# EAGLE schematic schematic (EAGLE 6.5.0)
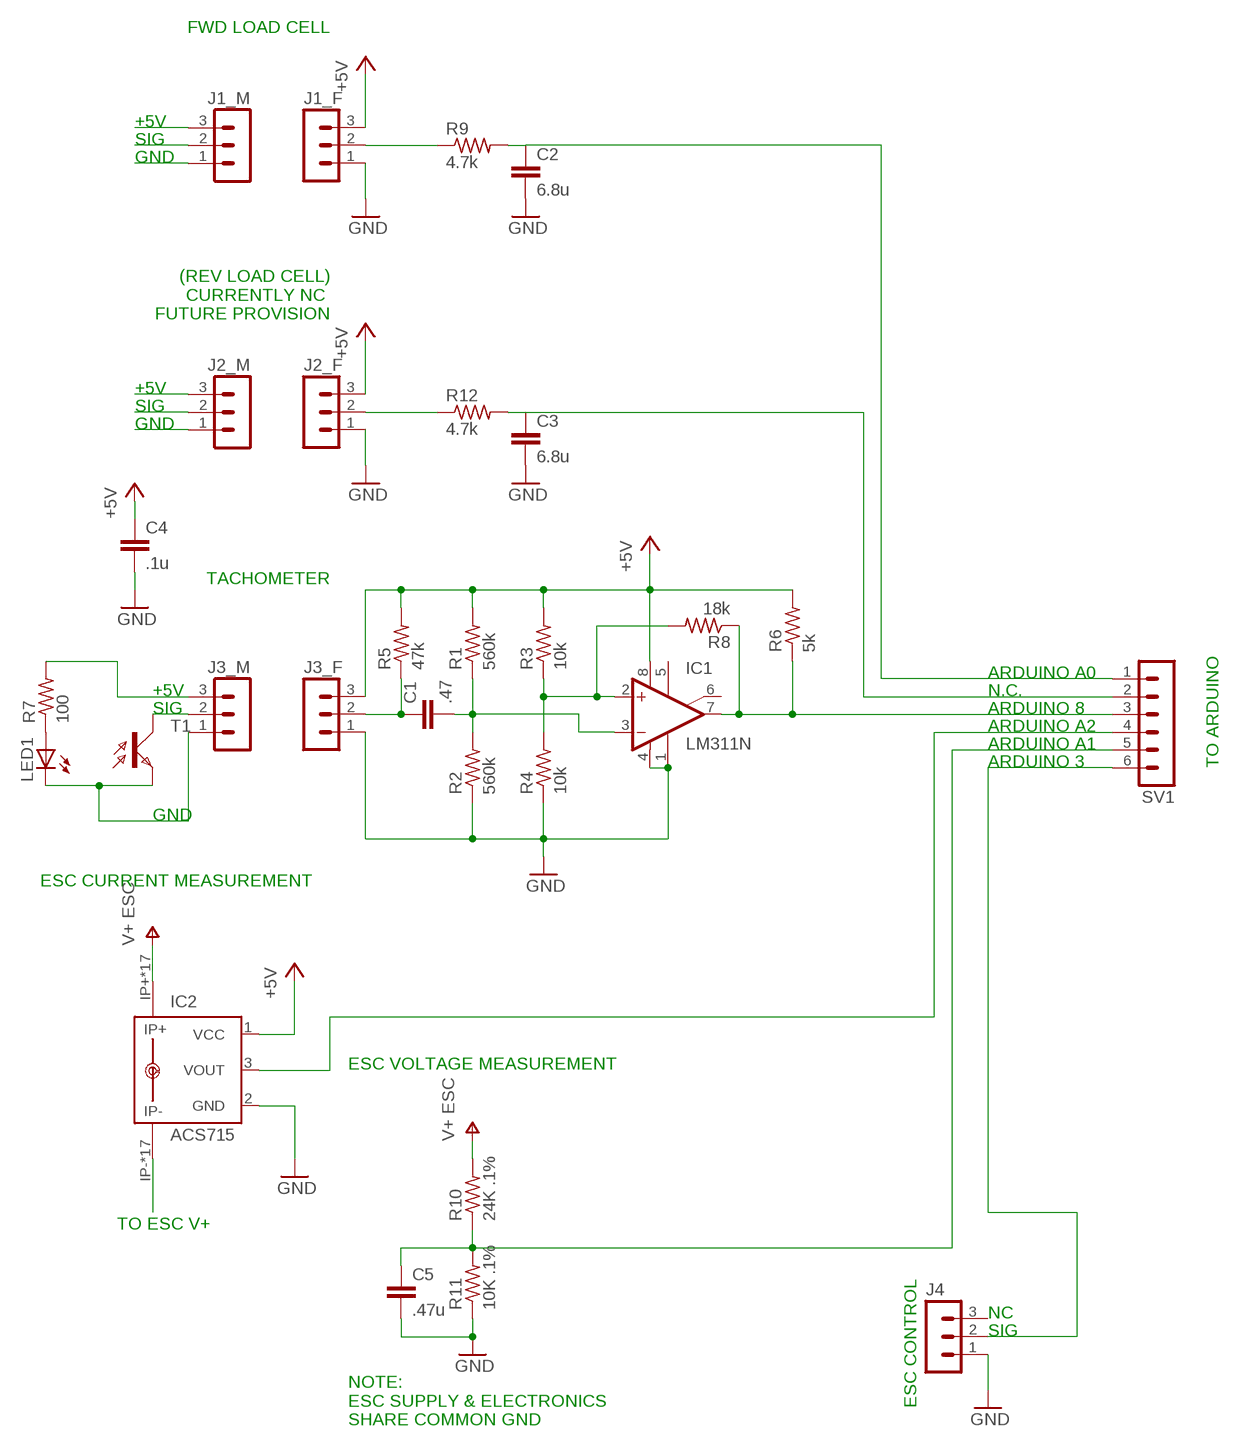
[diagram p0: schematic, sheet 1]

## Parts
C1  .47  C7.5/4  [C7.5B4]
C2  6.8u  C7.5/4  [C7.5B4]
C3  6.8u  C7.5/4  [C7.5B4]
C4  .1u  C7.5/4  [C7.5B4]
C5  .47u  C7.5/4  [C7.5B4]
IC1  LM311N  [DIL08]
IC2  ACS715  ACS750LCA-050  [ACS75050]
J1_F  MA03-1  [MA03-1]
J1_M  MA03-1  [MA03-1]
J2_F  MA03-1  [MA03-1]
J2_M  MA03-1  [MA03-1]
J3_F  MA03-1  [MA03-1]
J3_M  MA03-1  [MA03-1]
J4  MA03-1  [MA03-1]
LED1  LAP4-BOTTOM  [P47F-BOTTOM]
R1  560k  R-US_0207/10  [0207/10]
R2  560k  R-US_0207/10  [0207/10]
R3  10k  R-US_0207/10  [0207/10]
R4  10k  R-US_0207/10  [0207/10]
R5  47k  R-US_0207/10  [0207/10]
R6  5k  R-US_0207/10  [0207/10]
R7  100  R-US_0207/10  [0207/10]
R8  18k  R-US_0207/10  [0207/10]
R9  4.7k  R-US_0207/10  [0207/10]
R10  24K .1%  R-US_0207/10  [0207/10]
R11  10K .1%  R-US_0207/10  [0207/10]
R12  4.7k  R-US_0207/10  [0207/10]
SV1  MA06-1  [MA06-1]
T1  BPX81  [BPX81]

## Nets
+5V: C4.1 IC1.8(V+) IC2.1(VCC) J1_F.3 J2_F.3 J3_F.3 R1.2 R3.2 R5.2 R6.2
GND: C2.2 C3.2 C4.2 C5.2 IC1.1(GND) IC1.4(V-) IC2.2(GND) J1_F.1 J2_F.1 J3_F.1 J4.1 R2.1 R4.1 R11.1
N$1: C1.2 IC1.3(-IN) R1.1 R2.2
N$2: IC1.2(+IN) R3.1 R4.2 R8.2
N$3: LED1.A R7.1
N$4: C1.1 J3_F.2 R5.1
N$5: IC1.7(OUT) R6.1 R8.1 SV1.3
N$6: J3_M.3 R7.2
N$7: J3_M.1 LED1.C T1.E
N$8: J3_M.2 T1.C
N$9: C5.1 R10.1 R11.2 SV1.5
N$10: IC2.IP- IC2.IP-@2(IP-) IC2.IP-@3(IP-) IC2.IP-@4(IP-) IC2.IP-@5(IP-) IC2.IP-@6(IP-) IC2.IP-@7(IP-) IC2.IP-@8(IP-) IC2.IP-@9(IP-) IC2.IP-@10(IP-) IC2.IP-@11(IP-) IC2.IP-@12(IP-) IC2.IP-@13(IP-) IC2.IP-@14(IP-) IC2.IP-@15(IP-) IC2.IP-@16(IP-) IC2.IP-@17(IP-)
N$11: C2.1 R9.2 SV1.1
N$12: J1_F.2 R9.1
N$13: J1_M.3
N$14: J1_M.2
N$15: J1_M.1
N$16: C3.1 R12.2 SV1.2
N$17: J2_F.2 R12.1
N$18: J2_M.3
N$19: J2_M.2
N$20: J2_M.1
N$21: J4.2 SV1.6
N$23: IC2.3(VOUT) SV1.4
V+: IC2.IP+ IC2.IP+@2(IP+) IC2.IP+@3(IP+) IC2.IP+@4(IP+) IC2.IP+@5(IP+) IC2.IP+@6(IP+) IC2.IP+@7(IP+) IC2.IP+@8(IP+) IC2.IP+@9(IP+) IC2.IP+@10(IP+) IC2.IP+@11(IP+) IC2.IP+@12(IP+) IC2.IP+@13(IP+) IC2.IP+@14(IP+) IC2.IP+@15(IP+) IC2.IP+@16(IP+) IC2.IP+@17(IP+) R10.2 ; supply symbol labelled V+ ESC
Unconnected: IC1.5(ON) IC1.6(ON/STR) J4.3

## Notes on the sheet
- FWD LOAD CELL
- +5V
- SIG
- GND
- (REV LOAD CELL)
  CURRENTLY NC 
  FUTURE PROVISION
- +5V
- SIG
- GND
- TACHOMETER
- ARDUINO A0
- +5V | N.C.
- SIG | ARDUINO 8
- ARDUINO A2
- ARDUINO A1
- ARDUINO 3 | TO ARDUINO
- GND
- ESC CURRENT MEASUREMENT
- ESC VOLTAGE MEASUREMENT
- TO ESC V+
- NC
- SIG
- ESC CONTROL
- NOTE: 
  ESC SUPPLY & ELECTRONICS 
  SHARE COMMON GND

## Library data of the parts
C1-C5 = capacitor-wima:C: CAPACITOR naming: grid - package width
IC1 = linear:LM311: COMPARATOR
IC2 = allegro:ACS750*CA-050: Current Sensor display layer 49 Reference in BRD and place VIAs on circles Source: www.allegromicro.com/datafile/0750-050.pdf; MF: ALLEGRO MICROSYSTEMS, INC.; MPN: ACS750LCA-050; OC_FARNELL: 1457176; OC_NEWARK: 61H4464
J1_F J1_M J2_F J2_M J3_F J3_M J4 = con-lstb:MA03-1: PIN HEADER; OC_FARNELL: unknown; OC_NEWARK: unknown
LED1 = led:*P4: PointLED® Enhanced Thinfilm LED TOP & BOTTOM mount LS P47F, LR P47F, LA P47F, LY P47F, LT P4SG, LB P4SG, LW P4SG Source: http://catalog.osram-os.com .. LA_LR_LS_LY_P47F_Pb_free.pdf
R1-R12 = rcl:R-US_: RESISTOR, American symbol
SV1 = con-lstb:MA06-1: PIN HEADER; OC_FARNELL: unknown; OC_NEWARK: unknown
T1 = opto-trans-siemens:BPX81: PHOTO TRANSISTOR; OC_FARNELL: unknown; OC_NEWARK: unknown